# EAGLE schematic motiondetector (EAGLE 6.2)
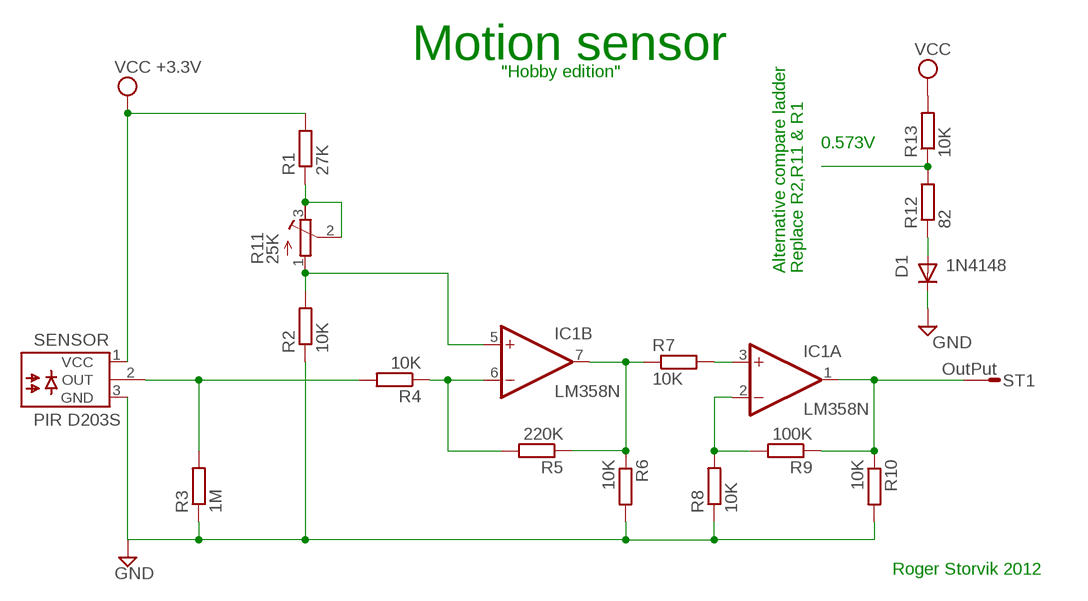
[diagram p0: schematic, sheet 1]

## Parts
D1  1N4148  1N4148DO35-7  [DO35-7]
IC1  LM358N  [DIL08]
R1  27K  R-EU_0204/5  [0204/5]
R2  10K  R-EU_0204/5  [0204/5]
R3  1M  R-EU_0204/5  [0204/5]
R4  10K  R-EU_0204/5  [0204/5]
R5  220K  R-EU_0204/5  [0204/5]
R6  10K  R-EU_0204/5  [0204/5]
R7  10K  R-EU_0204/5  [0204/5]
R8  10K  R-EU_0204/5  [0204/5]
R9  100K  R-EU_0204/5  [0204/5]
R10  10K  R-EU_0204/5  [0204/5]
R11  25K  R-TRIMM64W  [RTRIM64W]
R12  82  R-EU_0204/5  [0204/5]
R13  10K  R-EU_0204/5  [0204/5]
SENSOR  PIR D203S  HFD3031  [TO18PL3]
ST1  OutPut  ST2,8  [ST2,8]

## Nets
GND: D1.C R2.1 R3.1 R6.2 R8.1 R10.2 SENSOR.3(GND)
N$1: R1.1 R11.2(S) R11.3(A)
N$2: IC1.5(B:+IN) R2.2 R11.1(E)
N$3: IC1.7(B:OUT) R5.1 R6.1 R7.1
N$4: R3.2 R4.2 SENSOR.2(OUT)
N$5: IC1.6(B:-IN) R4.1 R5.2
N$6: D1.A R12.1
N$7: IC1.3(A:+IN) R7.2
N$8: IC1.2(A:-IN) R8.2 R9.2
N$9: IC1.1(A:OUT) R9.1 R10.1 ST1.1(ST)
N$10: R12.2 R13.1
VCC: R1.2 R13.2 SENSOR.1(VCC) ; supply symbol labelled VCC +3.3V

## Notes on the sheet
- Motion sensor
- "Hobby edition"
- 0.573V
- Alternative compare ladder | Replace R2,R11 & R1
- Roger Storvik 2012

## Power pins joined to a net without a drawn wire
V+: IC1.8(P:V+)
V-: IC1.4(P:V-)

## Library data of the parts
D1 = diode:1N4148: DIODE high speed (Philips)
IC1 = linear:LM358: OP AMP also LM158; LM258; LM2904 Source: http://cache.national.com/ds/LM/LM158.pdf
R1-R10 R12 R13 = resistor:R-EU_: RESISTOR, European symbol
R11 = resistor:R-TRIMM: Trimm resistor
SENSOR = opto-honeywell:HFD3031: OPTO SENSOR DEVICE; OC_FARNELL: unknown; OC_NEWARK: unknown
ST1 = con-rib:ST2,8: RIBBON CABLE CONNECTOR Flachstecker / Faston; OC_FARNELL: unknown; OC_NEWARK: unknown